# EAGLE design relocker_schematic (EAGLE 9.1.3)
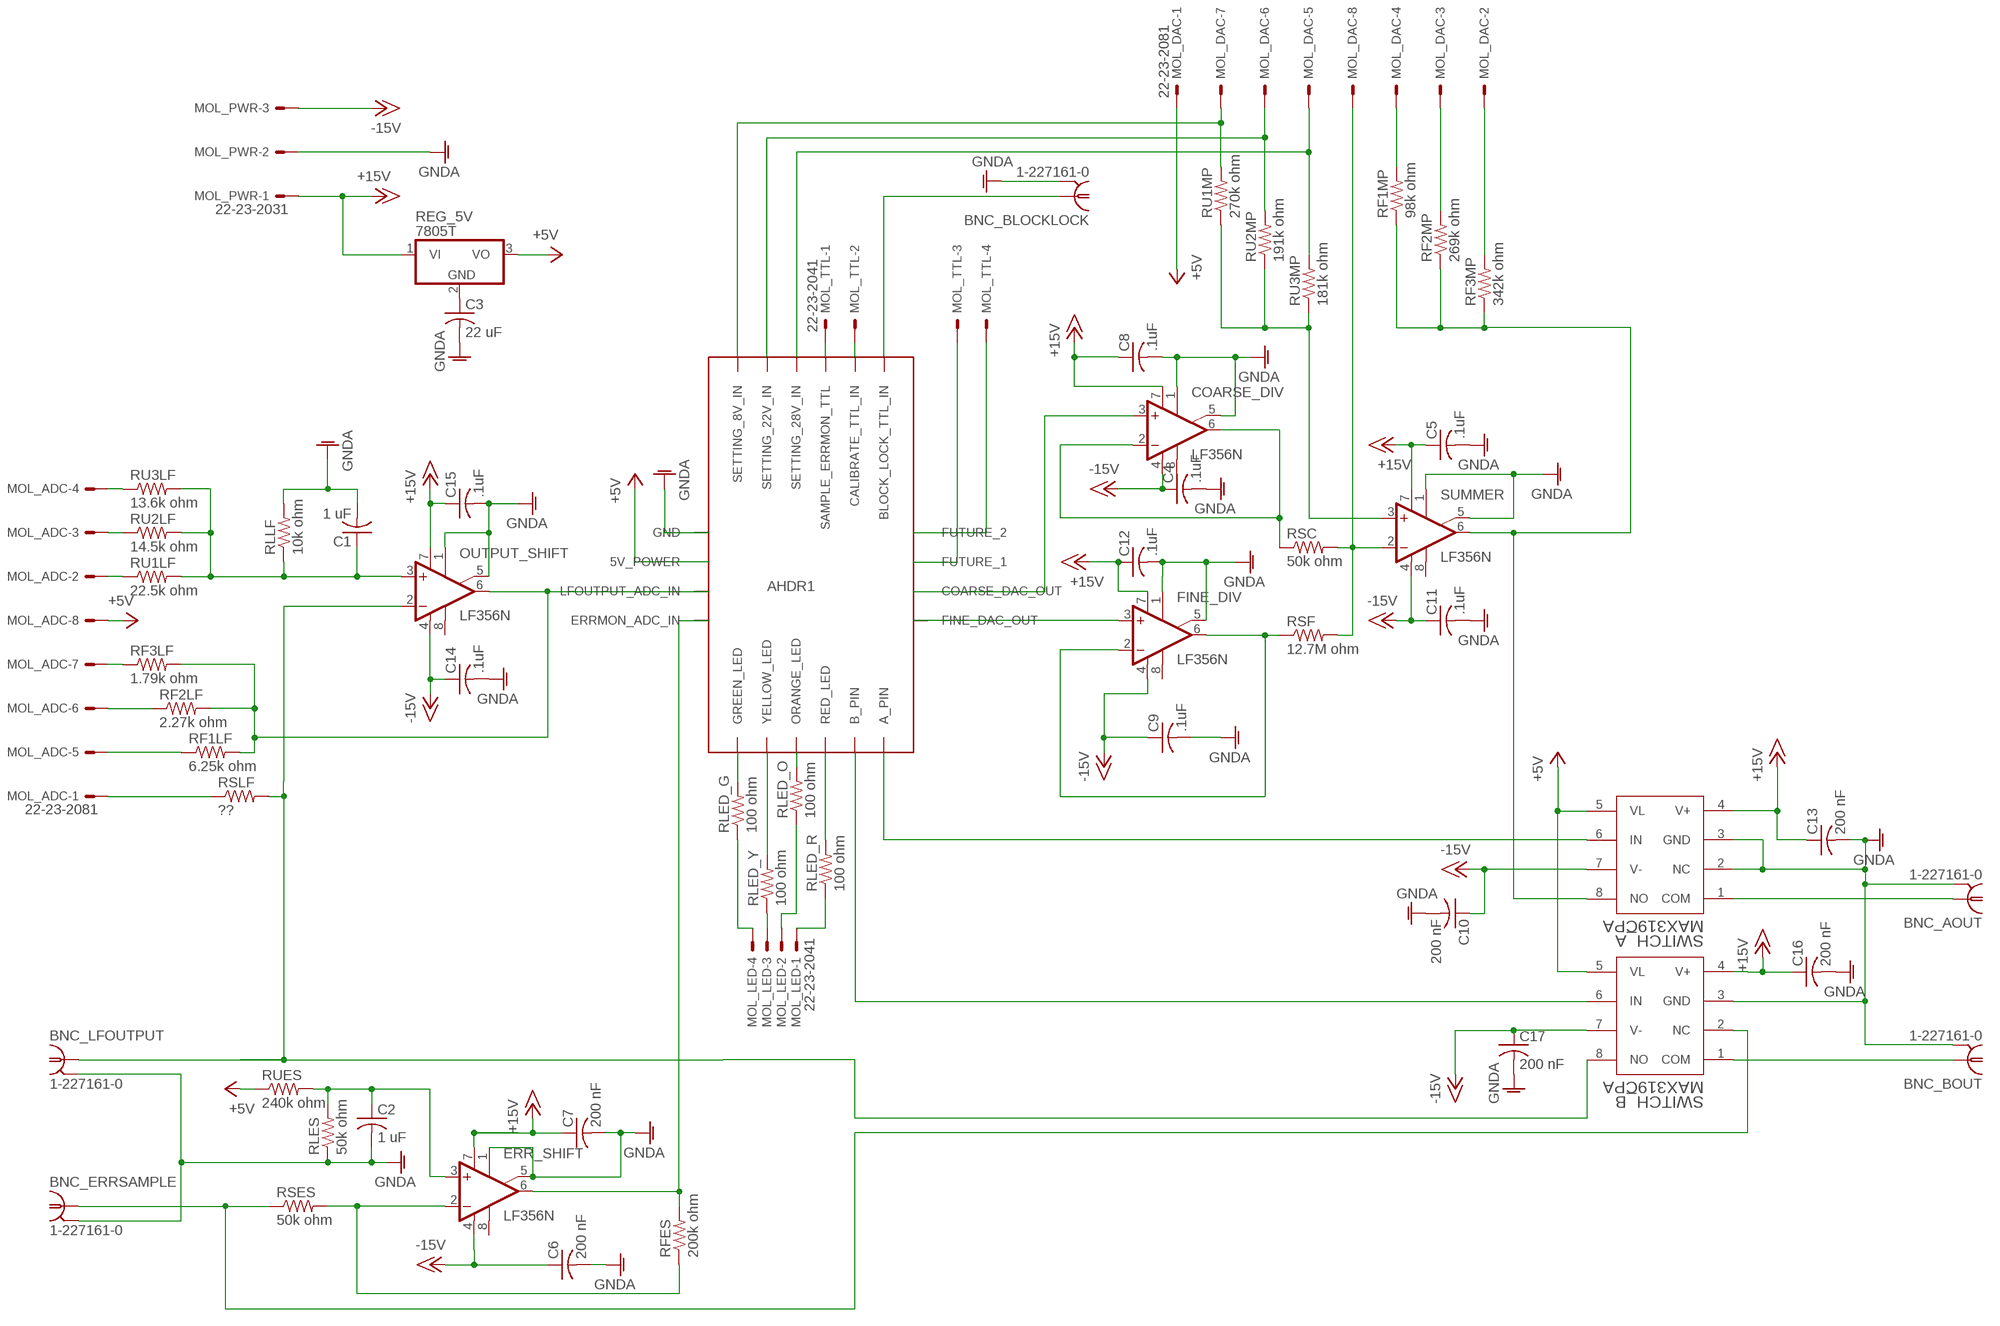
[diagram p0: schematic, sheet 1]

## Parts
AHDR1  FREESOC2_BREAKOUT  [FREESOC2_BREAKOUT]
BNC_AOUT  1-227161-0  [AMP_227161]
BNC_BLOCKLOCK  1-227161-0  [AMP_227161]
BNC_BOUT  1-227161-0  [AMP_227161]
BNC_ERRSAMPLE  1-227161-0  [AMP_227161]
BNC_LFOUTPUT  1-227161-0  [AMP_227161]
C1  1 uF  C-USC0805  [C0805]
C2  1 uF  C-USC0805  [C0805]
C3  22 uF  C-USC0805  [C0805]
C4  .1uF  C-USC0805  [C0805]
C5  .1uF  C-USC0805  [C0805]
C6  200 nF  C-USC0805  [C0805]
C7  200 nF  C-USC0805  [C0805]
C8  .1uF  C-USC0805  [C0805]
C9  .1uF  C-USC0805  [C0805]
C10  200 nF  C-USC0805  [C0805]
C11  .1uF  C-USC0805  [C0805]
C12  .1uF  C-USC0805  [C0805]
C13  200 nF  C-USC0805  [C0805]
C14  .1uF  C-USC0805  [C0805]
C15  .1uF  C-USC0805  [C0805]
C16  200 nF  C-USC0805  [C0805]
C17  200 nF  C-USC0805  [C0805]
COARSE_DIV  LF356N  [DIL08]
ERR_SHIFT  LF356N  [DIL08]
FINE_DIV  LF356N  [DIL08]
MOL_ADC  22-23-2081  [22-23-2081]
MOL_DAC  22-23-2081  [22-23-2081]
MOL_LED  22-23-2041  [22-23-2041]
MOL_PWR  22-23-2031  [22-23-2031]
MOL_TTL  22-23-2041  [22-23-2041]
OUTPUT_SHIFT  LF356N  [DIL08]
REG_5V  7805T  [TO220H]
RF1LF  6.25k ohm  R-US_R0805  [R0805]
RF1MP  98k ohm  R-US_R0805  [R0805]
RF2LF  2.27k ohm  R-US_R0805  [R0805]
RF2MP  269k ohm  R-US_R0805  [R0805]
RF3LF  1.79k ohm  R-US_R0805  [R0805]
RF3MP  342k ohm  R-US_R0805  [R0805]
RFES  200k ohm  R-US_R0805  [R0805]
RLED_G  100 ohm  R-US_R0805  [R0805]
RLED_O  100 ohm  R-US_R0805  [R0805]
RLED_R  100 ohm  R-US_R0805  [R0805]
RLED_Y  100 ohm  R-US_R0805  [R0805]
RLES  50k ohm  R-US_R0805  [R0805]
RLLF  10k ohm  R-US_R0805  [R0805]
RSC  50k ohm  R-US_R0805  [R0805]
RSES  50k ohm  R-US_R0805  [R0805]
RSF  12.7M ohm  R-US_R0805  [R0805]
RSLF  ??  R-US_R0805  [R0805]
RU1LF  22.5k ohm  R-US_R0805  [R0805]
RU1MP  270k ohm  R-US_R0805  [R0805]
RU2LF  14.5k ohm  R-US_R0805  [R0805]
RU2MP  191k ohm  R-US_R0805  [R0805]
RU3LF  13.6k ohm  R-US_R0805  [R0805]
RU3MP  181k ohm  R-US_R0805  [R0805]
RUES  240k ohm  R-US_R0805  [R0805]
SUMMER  LF356N  [DIL08]
SWITCH_A  MAX319CPA  [21-0043D_8]
SWITCH_B  MAX319CPA  [21-0043D_8]

## Nets
+5V: AHDR1.1(5V_POWER) MOL_ADC.8 MOL_DAC.1 REG_5V.3(VO) RUES.1 SWITCH_A.5(VL) SWITCH_B.5(VL)
+15V: C5.1 C7.1 C8.1 C12.1 C13.1 C15.1 C16.1 COARSE_DIV.7(V+) ERR_SHIFT.7(V+) FINE_DIV.7(V+) MOL_PWR.1 OUTPUT_SHIFT.7(V+) REG_5V.1(VI) SUMMER.7(V+) SWITCH_A.4(V+) SWITCH_B.4(V+)
-15V: C4.1 C6.1 C9.1 C10.1 C11.1 C14.1 C17.1 COARSE_DIV.4(V-) ERR_SHIFT.4(V-) FINE_DIV.4(V-) MOL_PWR.3 OUTPUT_SHIFT.4(V-) SUMMER.4(V-) SWITCH_A.7(V-) SWITCH_B.7(V-)
GNDA: AHDR1.2(GND) BNC_AOUT.2 BNC_BLOCKLOCK.2 BNC_BOUT.2 BNC_ERRSAMPLE.2 BNC_LFOUTPUT.2 C1.2 C2.2 C3.1 C3.2 C4.2 C5.2 C6.2 C7.2 C8.2 C9.2 C10.2 C11.2 C12.2 C13.2 C14.2 C15.2 C16.2 C17.2 COARSE_DIV.1(ON1) COARSE_DIV.5(ON2) ERR_SHIFT.1(ON1) ERR_SHIFT.5(ON2) FINE_DIV.1(ON1) FINE_DIV.5(ON2) MOL_PWR.2 OUTPUT_SHIFT.1(ON1) OUTPUT_SHIFT.5(ON2) REG_5V.2(GND) RLES.1 RLLF.2 SUMMER.1(ON1) SUMMER.5(ON2) SWITCH_A.2(NC) SWITCH_A.3(GND) SWITCH_B.3(GND)
N$1: AHDR1.10(COARSE_DAC_OUT) COARSE_DIV.3(+IN)
N$2: COARSE_DIV.2(-IN) COARSE_DIV.6(OUT) RSC.1
N$3: MOL_DAC.4 RF1MP.2
N$4: AHDR1.11(FINE_DAC_OUT) FINE_DIV.3(+IN)
N$5: AHDR1.12(BLOCK_LOCK_TTL_IN) BNC_BLOCKLOCK.1
N$6: AHDR1.17(RED_LED) RLED_R.2
N$7: AHDR1.18(ORANGE_LED) RLED_O.2
N$8: AHDR1.19(YELLOW_LED) RLED_Y.2
N$9: AHDR1.20(GREEN_LED) RLED_G.2
N$10: MOL_LED.4 RLED_G.1
N$11: MOL_LED.3 RLED_Y.1
N$12: MOL_LED.2 RLED_O.1
N$13: MOL_LED.1 RLED_R.1
N$14: BNC_AOUT.1 SWITCH_A.1(COM)
N$15: RF1MP.1 RF2MP.1 RF3MP.1 SUMMER.6(OUT) SWITCH_A.8(NO)
N$16: AHDR1.6(A_PIN) SWITCH_A.6(IN)
N$17: BNC_BOUT.1 SWITCH_B.1(COM)
N$18: BNC_ERRSAMPLE.1 RSES.1 SWITCH_B.2(NC)
N$19: AHDR1.9(SETTING_8V_IN) MOL_DAC.7 RU1MP.2
N$20: AHDR1.5(B_PIN) SWITCH_B.6(IN)
N$21: BNC_LFOUTPUT.1 OUTPUT_SHIFT.2(-IN) RSLF.2 SWITCH_B.8(NO)
N$22: AHDR1.8(SETTING_22V_IN) MOL_DAC.6 RU2MP.2
N$23: AHDR1.7(SETTING_28V_IN) MOL_DAC.5 RU3MP.2
N$24: AHDR1.3(LFOUTPUT_ADC_IN) OUTPUT_SHIFT.6(OUT) RF1LF.2 RF2LF.2 RF3LF.2
N$25: MOL_DAC.8 RSC.2 RSF.2 SUMMER.2(-IN)
N$26: FINE_DIV.2(-IN) FINE_DIV.6(OUT) RSF.1
N$27: MOL_DAC.3 RF2MP.2
N$28: MOL_DAC.2 RF3MP.2
N$29: RU1MP.1 RU2MP.1 RU3MP.1 SUMMER.3(+IN)
N$30: MOL_ADC.1 RSLF.1
N$31: MOL_ADC.5 RF1LF.1
N$32: MOL_ADC.6 RF2LF.1
N$33: MOL_ADC.7 RF3LF.1
N$34: MOL_ADC.2 RU1LF.1
N$35: MOL_ADC.3 RU2LF.1
N$36: MOL_ADC.4 RU3LF.1
N$37: C1.1 OUTPUT_SHIFT.3(+IN) RLLF.1 RU1LF.2 RU2LF.2 RU3LF.2
N$38: ERR_SHIFT.2(-IN) RFES.1 RSES.2
N$39: C2.1 ERR_SHIFT.3(+IN) RLES.2 RUES.2
N$40: AHDR1.4(ERRMON_ADC_IN) ERR_SHIFT.6(OUT) RFES.2
N$41: AHDR1.15(FUTURE_1) MOL_TTL.3
N$42: AHDR1.16(FUTURE_2) MOL_TTL.4
N$43: AHDR1.14(CALIBRATE_TTL_IN) MOL_TTL.2
N$44: AHDR1.13(SAMPLE_ERRMON_TTL) MOL_TTL.1
Unconnected: COARSE_DIV.8(OPT) ERR_SHIFT.8(OPT) FINE_DIV.8(OPT) OUTPUT_SHIFT.8(OPT) SUMMER.8(OPT)

## Library data of the parts
AHDR1 = custom_parts_library:FREESOC2_BREAKOUT: Breakout FreeSoc2 Pins For the relocker project
BNC_AOUT BNC_BLOCKLOCK BNC_BOUT BNC_ERRSAMPLE BNC_LFOUTPUT = con-coax:?227161*: JACK, RIGHT ANGLE, 50 OHM, PCB, BNC Source: amp_227161.pdf; MF: TYCO ELECTRONICS; MPN: 1-227161; OC_FARNELL: unknown; OC_NEWARK: 33B3200
C1-C17 = rcl:C-US: CAPACITOR, American symbol; SPICEPREFIX: C
COARSE_DIV ERR_SHIFT FINE_DIV OUTPUT_SHIFT SUMMER = linear:LF356: OP AMP
MOL_ADC MOL_DAC = con-molex:22-23-2081: .100" (2.54mm) Center Header - 8 Pin; MF: MOLEX; MPN: 22-23-2081; OC_FARNELL: 1756826; OC_NEWARK: 01C7592
MOL_LED MOL_TTL = con-molex:22-23-2041: .100" (2.54mm) Center Header - 4 Pin; MF: MOLEX; MPN: 22-23-2041; OC_FARNELL: 1462920; OC_NEWARK: 38C0355
MOL_PWR = con-molex:22-23-2031: .100" (2.54mm) Center Header - 3 Pin; MF: MOLEX; MPN: 22-23-2031; OC_FARNELL: 1462950; OC_NEWARK: 30C0862
REG_5V = linear:78*: Positive VOLTAGE REGULATOR Source: http://cache.national.com/ds/LM/LM78L05.pdf http://www.fairchildsemi.com/ds/LM/LM7805.pdf
RF1LF RF1MP RF2LF RF2MP RF3LF RF3MP RFES RLED_G RLED_O RLED_R RLED_Y RLES RLLF RSC RSES RSF RSLF RU1LF RU1MP RU2LF RU2MP RU3LF RU3MP RUES = rcl:R-US_: RESISTOR, American symbol; SPICEPREFIX: R
SWITCH_A SWITCH_B = custom_parts_library:MAX319CPA: Maxim MAX319CPA This switch was imported with Ultra Librarian and then the schematic was edited, but the footprint looks good, I hope.; MANUFACTURER_PART_NUMBER: MAX319CPA; VENDOR: Maxim

## Board
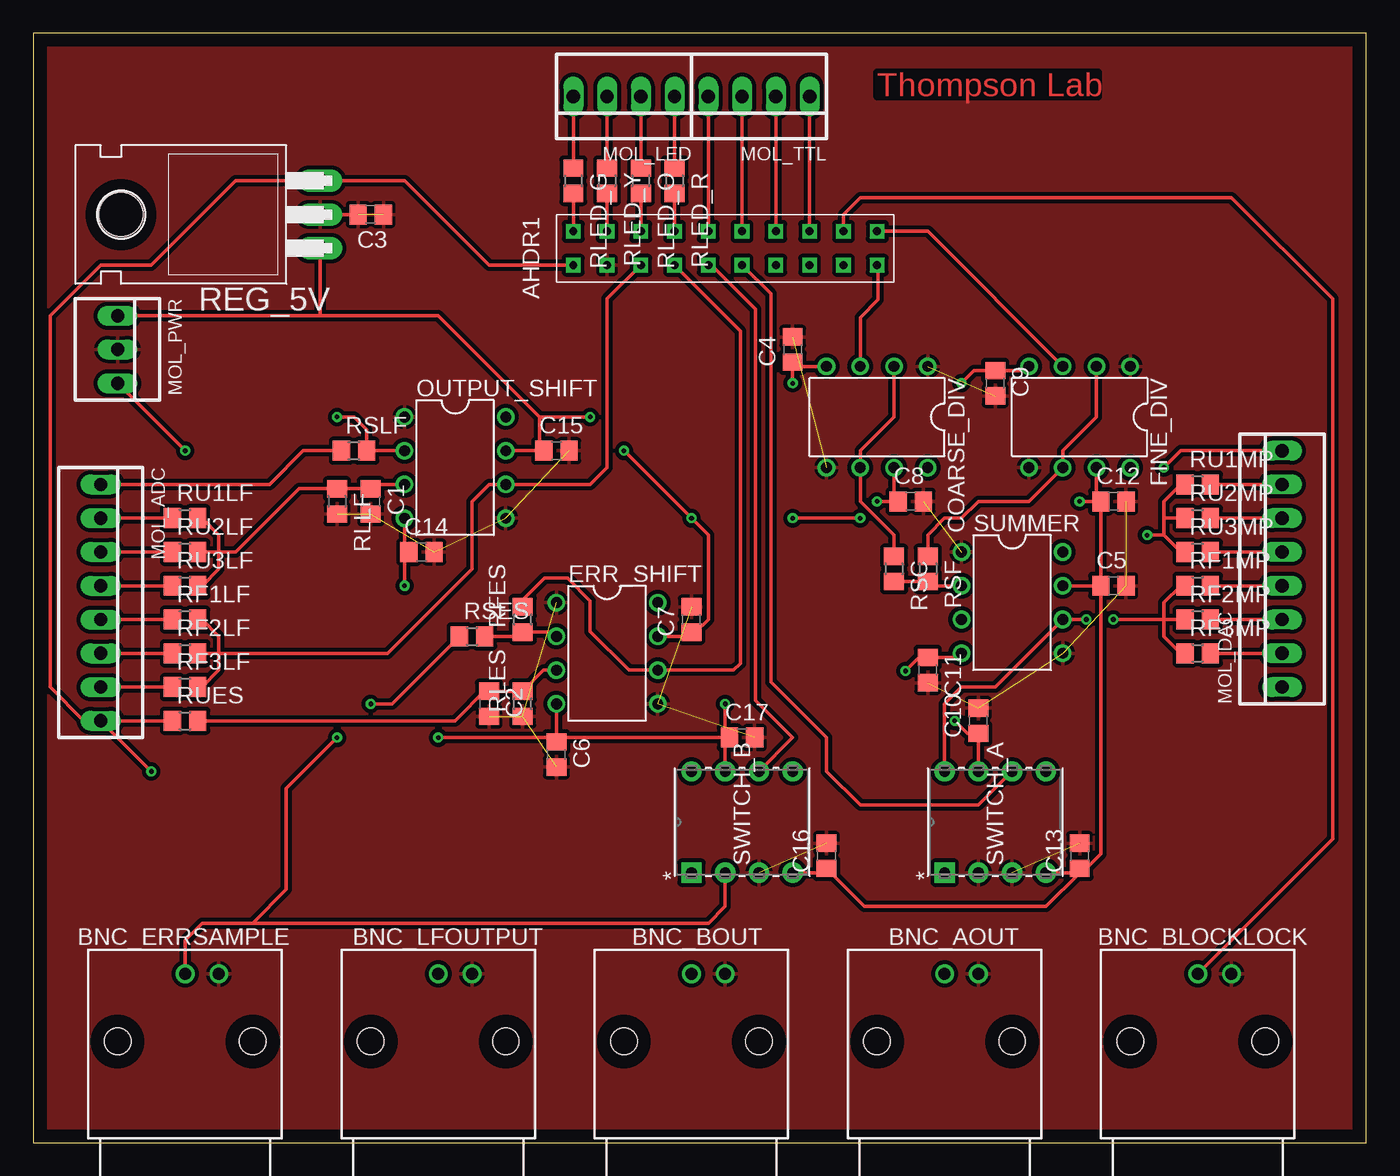
[diagram p1: board, top side]
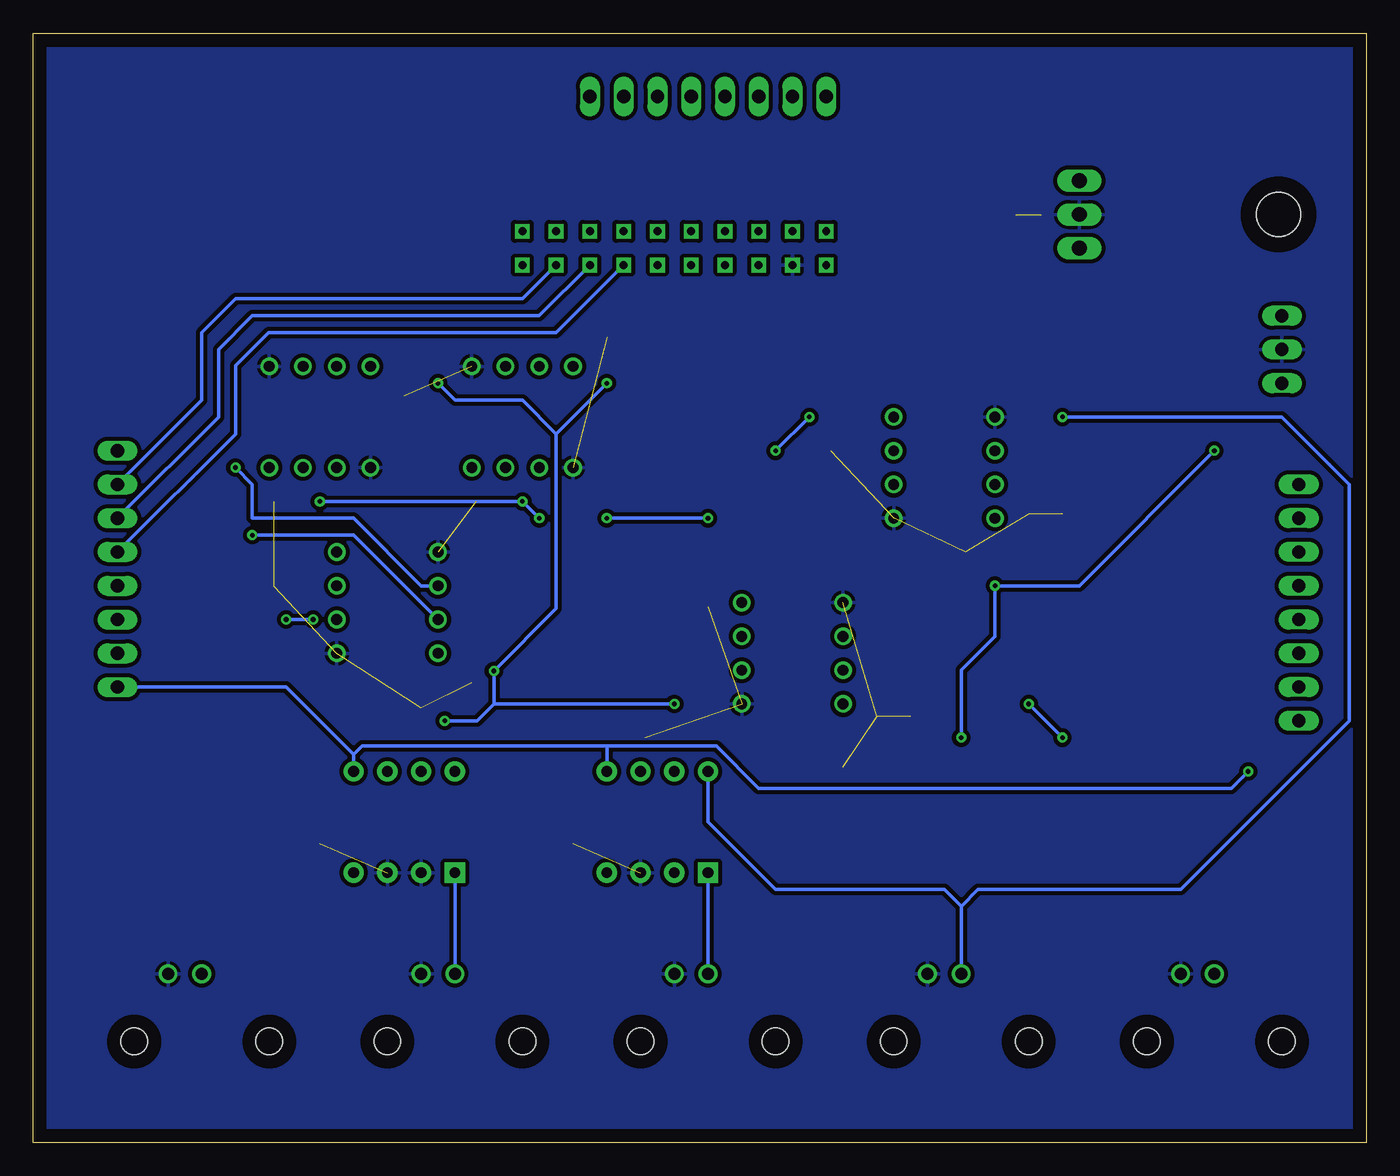
[diagram p2: board, bottom side, seen from below]

Size 100.31 x 83.49 mm. Coordinates in mm from the lower left corner, seen from the top.
Outline: 0,0 100.31,0 100.31,83.49 0,83.49 0,0
Copper layers (1*16): Top 0.035mm / dielectric 1.5mm / Bottom 0.035mm
Design rules "default": minimum track width 6mil, minimum drill 0.35mm, track to track 6mil, track to pad 6mil, pad to pad 6mil, via to via 6mil, smd to smd 6mil, copper to edge 40mil, drill to drill 6mil, minimum pad ring 10mil, minimum via ring 8mil, stop-mask expansion 4mil, vias tented up to drill 0mil, thermal gap 10mil

### Footprints (pad centres in the part's own frame; a part is rotated, then mirrored left to right if it is on the bottom)
FREESOC2_BREAKOUT = drill 0.6 square: 1 1.27,-1.27; 2 1.27,-3.81; 3 1.27,-6.35; 4 1.27,-8.89; 5 1.27,-11.43; 6 1.27,-13.97; 7 1.27,-16.51; 8 1.27,-19.05; 9 1.27,-21.59; 10 1.27,-24.13; 11 3.81,-24.13; 12 3.81,-21.59; 13 3.81,-19.05; 14 3.81,-16.51; 15 3.81,-13.97; 16 3.81,-11.43; 17 3.81,-8.89; 18 3.81,-6.35; 19 3.81,-3.81; 20 3.81,-1.27
AMP_227161 = drill 0.9 pad 1.27: 1 0,-5.08; 2 -2.54,-5.08 | hole 2: -5.08,0; 5.08,0
C0805 = smd 1.3 x 1.5: 1 -0.95,0; 2 0.95,0
DIL08 = drill 0.813 pad 1.27: 1 -3.81,-3.81; 2 -1.27,-3.81; 3 1.27,-3.81; 4 3.81,-3.81; 5 3.81,3.81; 6 1.27,3.81; 7 -1.27,3.81; 8 -3.81,3.81
22-23-2081 = drill 1 long: 1 -8.89,0; 2 -6.35,0; 3 -3.81,0; 4 -1.27,0; 5 1.27,0; 6 3.81,0; 7 6.35,0; 8 8.89,0
22-23-2041 = drill 1 long: 1 -3.81,0; 2 -1.27,0; 3 1.27,0; 4 3.81,0
22-23-2031 = drill 1 long: 1 -2.54,0; 2 0,0; 3 2.54,0
TO220H = drill 1.118 long: 1 -2.54,-10.16; 2 0,-10.16; 3 2.54,-10.16 | hole 3.302: 0,4.826
R0805 = smd 1.3 x 1.5: 1 -0.95,0; 2 0.95,0
21-0043D_8 = drill 0.813 pad 1.524 square: 1 -7.62,7.62 | drill 0.813 pad 1.524: 2 -7.62,5.08; 3 -7.62,2.54; 4 -7.62,0; 5 0,0; 6 0,2.54; 7 0,5.08; 8 0,7.62

### Placement (x,y rotation side)
AHDR1  39.37,64.77 90 top
BNC_AOUT  68.58,7.62 180 top
BNC_BLOCKLOCK  87.63,7.62 180 top
BNC_BOUT  49.53,7.62 180 top
BNC_ERRSAMPLE  11.43,7.62 180 top
BNC_LFOUTPUT  30.48,7.62 180 top
C1  25.4,48.26 270 top
C2  34.29,33.02 270 top
C3  25.4,69.85 180 top
C4  57.15,59.69 90 top
C5  81.28,41.91 0 top
C6  39.37,29.21 270 top
C7  49.53,39.37 90 top
C8  66.04,48.26 0 top
C9  72.39,57.15 270 top
C10  71.12,31.75 90 top
C11  67.31,35.56 270 top
C12  81.28,48.26 0 top
C13  78.74,21.59 90 top
C14  29.21,44.45 0 top
C15  39.37,52.07 0 top
C16  59.69,21.59 90 top
C17  53.34,30.48 0 top
COARSE_DIV  63.5,54.61 180 top
ERR_SHIFT  43.18,36.83 270 top
FINE_DIV  78.74,54.61 180 top
MOL_ADC  5.08,40.64 270 top
MOL_DAC  93.98,43.18 90 top
MOL_LED  44.45,78.74 180 top
MOL_PWR  6.35,59.69 270 top
MOL_TTL  54.61,78.74 180 top
OUTPUT_SHIFT  31.75,50.8 270 top
REG_5V  11.43,69.85 90 top
RF1LF  11.43,39.37 0 top
RF1MP  87.63,41.91 0 top
RF2LF  11.43,36.83 0 top
RF2MP  87.63,39.37 0 top
RF3LF  11.43,34.29 0 top
RF3MP  87.63,36.83 0 top
RFES  36.83,39.37 90 top
RLED_G  40.64,72.39 270 top
RLED_O  45.72,72.39 270 top
RLED_R  48.26,72.39 270 top
RLED_Y  43.18,72.39 270 top
RLES  36.83,33.02 90 top
RLLF  22.86,48.26 270 top
RSC  64.77,43.18 270 top
RSES  33.02,38.1 0 top
RSF  67.31,43.18 270 top
RSLF  24.13,52.07 0 top
RU1LF  11.43,46.99 0 top
RU1MP  87.63,49.53 0 top
RU2LF  11.43,44.45 0 top
RU2MP  87.63,46.99 0 top
RU3LF  11.43,41.91 0 top
RU3MP  87.63,44.45 0 top
RUES  11.43,31.75 0 top
SUMMER  73.66,40.64 270 top
SWITCH_A  76.2,27.94 90 top
SWITCH_B  57.15,27.94 90 top

### Tracks (layer width: path | path; a pad name or v marks a point on that pad's centre or on a via)
+5V  (via drill 0.35)
  Top 0.254: MOL_ADC.8 3.81,31.75 1.27,34.29 1.27,62.23 5.08,66.04 8.89,66.04 15.24,72.39 REG_5V.3 27.94,72.39 34.29,66.04 AHDR1.1 | MOL_ADC.8 RUES.1 | v8.89,27.94 MOL_ADC.8
  Bottom 0.254: 57.15,29.84 75.56,29.84 76.2,29.21 | 57.15,29.84 48.89,29.84 45.72,26.67 10.16,26.67 v8.89,27.94 | SWITCH_A.5 76.2,29.21 | SWITCH_B.5 57.15,29.84 | 76.2,29.21 81.28,34.29 MOL_DAC.1
+15V  (via drill 0.35)
  Top 0.254: 21.59,62.23 30.48,62.23 38.1,54.61 | OUTPUT_SHIFT.7 C15.1 38.1,52.39 38.1,54.61 | 78.74,20.32 C13.1 79.25,20.64 80.33,21.72 C5.1 | SWITCH_A.4 78.74,20.32 | SWITCH_B.4 59.69,20.32 C16.1 62.55,17.78 76.2,17.78 78.74,20.32 | v41.91,54.61 38.1,54.61 | 80.01,48.26 C12.1 C5.1 | 80.01,48.26 v78.74,48.26 | v63.5,48.26 64.77,48.26 | 64.77,48.26 C8.1 | v62.23,46.99 v57.15,46.99 | SUMMER.7 C5.1 | FINE_DIV.7 80.01,48.26 | COARSE_DIV.7 64.77,48.26 | MOL_PWR.1 21.59,62.23 | v44.45,52.07 v49.53,46.99 50.8,45.72 50.8,39.37 49.85,38.42 C7.1 49.21,38.1 ERR_SHIFT.7 | REG_5V.1 21.59,62.23
  Bottom 0.254: v44.45,52.07 v41.91,54.61 | v78.74,48.26 v63.5,48.26 v62.23,46.99 | v57.15,46.99 v49.53,46.99
-15V  (via drill 0.35)
  Top 0.254: OUTPUT_SHIFT.4 27.94,44.77 C14.1 27.94,44.45 v27.94,41.91 | FINE_DIV.4 74.61,58.1 C9.1 70.8,58.1 v69.85,57.15 | SUMMER.4 69.53,36.51 C11.1 66.65,36.51 v65.65,35.5 | v69.34,31.75 70.29,30.8 C10.1 SWITCH_A.7 | 52.07,30.48 C17.1 52.07,30.8 v52.07,33.02 | SWITCH_B.7 52.07,30.48 | COARSE_DIV.4 57.47,58.42 C4.1 v57.15,57.15 | v11.43,52.07 MOL_PWR.3 | C6.1 ERR_SHIFT.4 | C6.1 39.05,30.48 v30.48,30.48 | C6.1 39.69,30.48 52.07,30.48
  Bottom 0.254: 60.96,53.34 60.96,40.19 v65.65,35.5 65.65,33.02 | v11.43,52.07 21.59,41.91 v27.94,41.91 27.94,38.1 30.48,35.56 v30.48,30.48 | v52.07,33.02 65.65,33.02 | 65.65,33.02 66.92,31.75 v69.34,31.75 | v69.85,57.15 68.58,55.88 63.5,55.88 60.96,53.34 | v57.15,57.15 60.96,53.34
GNDA  (19 unrouted)
  Top 0.254: C3.2 REG_5V.2
  pour Bottom (isolate 0.305): 0,100.33 100.33,100.33 100.33,0 0,0
  pour Top (isolate 0.305): 0,83.82 100.33,83.82 100.33,0 0,0
N$1
  Top 0.254: AHDR1.10 63.5,65.91 63.56,65.85 63.56,63.44 62.23,62.1 COARSE_DIV.3
N$2
  Top 0.254: RSC.1 64.77,45.72 62.23,48.26 COARSE_DIV.6 62.23,52.07 64.77,54.61 COARSE_DIV.2
N$3
  Top 0.254: RF1MP.2 MOL_DAC.4
N$4
  Top 0.254: AHDR1.11 67.31,68.58 FINE_DIV.3
N$5
  Top 0.254: AHDR1.12 60.96,69.85 62.23,71.12 90.17,71.12 97.79,63.5 97.79,22.86 BNC_BLOCKLOCK.1
N$6
  Top 0.254: AHDR1.17 RLED_R.2
N$7
  Top 0.254: AHDR1.18 RLED_O.2
N$8
  Top 0.254: AHDR1.19 RLED_Y.2
N$9
  Top 0.254: AHDR1.20 RLED_G.2
N$10
  Top 0.254: RLED_G.1 MOL_LED.4
N$11
  Top 0.254: RLED_Y.1 MOL_LED.3
N$12
  Top 0.254: RLED_O.1 MOL_LED.2
N$13
  Top 0.254: RLED_R.1 MOL_LED.1
N$14
  Bottom 0.254: SWITCH_A.1 BNC_AOUT.1
N$15  (via drill 0.35)
  Top 0.254: SWITCH_A.8 68.58,33.02 69.85,34.29 72.39,34.29 74.93,36.83 SUMMER.6 v79.25,39.37 | RF3MP.1 86.36,36.83 85.09,38.1 85.09,39.37 | RF1MP.1 86.36,41.91 85.09,40.64 85.09,39.37 | RF2MP.1 85.09,39.37 | v81.28,39.37 85.09,39.37
  Bottom 0.254: v79.25,39.37 v81.28,39.37
N$16
  Top 0.254: AHDR1.6 55.5,63.88 55.5,34.67 59.69,30.48 59.69,27.94 62.23,25.4 71.12,25.4 SWITCH_A.6
N$17
  Bottom 0.254: SWITCH_B.1 BNC_BOUT.1
N$18  (via drill 0.35)
  Top 0.254: BNC_ERRSAMPLE.1 11.43,15.24 12.7,16.51 16.51,16.51 | SWITCH_B.2 52.07,17.78 50.8,16.51 16.51,16.51 | v22.86,30.48 19.05,26.67 19.05,19.05 16.51,16.51 | v25.4,33.02 26.99,33.02 RSES.1
  Bottom 0.254: v25.4,33.02 v22.86,30.48
N$19
  Top 0.254: RU1MP.2 MOL_DAC.7
  Bottom 0.254: AHDR1.9 63.5,63.5 85.09,63.5 87.63,60.96 87.63,55.88 MOL_DAC.7
N$20
  Top 0.254: AHDR1.5 50.8,66.27 54.36,62.72 54.36,33.27 57.15,30.48 SWITCH_B.6
N$21  (via drill 0.35)
  Top 0.254: OUTPUT_SHIFT.2 25.4,52.07 RSLF.2 25.08,53.66 24.13,54.61 v22.86,54.61
  Bottom 0.254: 5.08,53.34 1.27,49.53 1.27,31.75 13.97,19.05 29.21,19.05 30.48,17.78 | 5.08,53.34 | 5.08,53.34 6.35,54.61 v22.86,54.61 | BNC_LFOUTPUT.1 30.48,17.78 | 30.48,17.78 31.75,19.05 44.45,19.05 49.53,24.13 SWITCH_B.8
N$22
  Top 0.254: RU2MP.2 MOL_DAC.6
  Bottom 0.254: AHDR1.8 62.23,62.23 83.82,62.23 86.36,59.69 86.36,54.61 MOL_DAC.6
N$23
  Top 0.254: RU3MP.2 MOL_DAC.5
  Bottom 0.254: AHDR1.7 60.96,60.96 82.61,60.96 85.09,58.48 85.09,53.34 MOL_DAC.5
N$24
  Top 0.254: RF3LF.2 12.7,34.29 13.97,35.56 13.97,36.83 | 13.97,36.83 13.97,38.1 12.7,39.37 RF1LF.2 | RF2LF.2 13.97,36.83 | 13.97,36.83 26.67,36.83 33.02,43.18 33.02,48.26 34.29,49.53 OUTPUT_SHIFT.6 41.91,49.53 43.18,50.8 43.18,62.23 43.18,63.5 AHDR1.3
N$25  (via drill 0.35)
  Top 0.254: RSC.2 RSF.2 67.63,41.91 SUMMER.2 | v85.09,50.8 86.36,52.07 MOL_DAC.8
  Bottom 0.254: SUMMER.2 71.12,41.91 76.2,46.99 83.82,46.99 83.82,49.53 v85.09,50.8
N$26
  Top 0.254: RSF.1 67.31,45.72 68.58,46.99 69.85,46.99 71.12,48.26 74.93,48.26 FINE_DIV.6 77.47,52.07 80.01,54.61 FINE_DIV.2
N$27
  Top 0.254: MOL_DAC.3 RF2MP.2
N$28
  Top 0.254: RF3MP.2 MOL_DAC.2
N$29  (via drill 0.35)
  Top 0.254: RU3MP.1 86.36,44.45 85.09,45.72 | 85.09,46.99 85.09,48.26 86.36,49.53 RU1MP.1 | RU2MP.1 85.09,46.99 | 85.09,46.99 85.09,45.72 | 85.09,45.72 | 85.09,45.72 v83.82,45.72
  Bottom 0.254: SUMMER.3 76.2,45.72 v83.82,45.72
N$30
  Top 0.254: RSLF.1 20.32,52.07 17.78,49.53 MOL_ADC.1
N$31
  Top 0.254: MOL_ADC.5 RF1LF.1
N$32
  Top 0.254: RF2LF.1 MOL_ADC.6
N$33
  Top 0.254: RF3LF.1 MOL_ADC.7
N$34
  Top 0.254: RU1LF.1 MOL_ADC.2
N$35
  Top 0.254: MOL_ADC.3 RU2LF.1
N$36
  Top 0.254: RU3LF.1 MOL_ADC.4
N$37
  Top 0.254: RU1LF.2 12.7,46.99 13.97,45.72 13.97,44.45 | 13.97,44.45 13.97,43.18 12.7,41.91 RU3LF.2 | RU2LF.2 13.97,44.45 | 13.97,44.45 | 13.97,44.45 15.24,44.45 20,49.21 RLLF.1 C1.1 25.72,49.53 OUTPUT_SHIFT.3
N$38
  Top 0.254: ERR_SHIFT.2 39.05,38.42 RFES.1 36.51,38.1 RSES.2
N$39
  Top 0.254: RUES.2 31.75,31.75 34.13,34.13 C2.1 RLES.2 38.42,35.56 ERR_SHIFT.3
N$40
  Top 0.254: AHDR1.4 53.21,61.09 53.21,36.07 52.7,35.56 ERR_SHIFT.6 44.83,35.56 41.91,38.48 41.91,40.77 40.2,42.48 38.48,42.48 36.83,40.83 RFES.2
N$41
  Top 0.254: AHDR1.15 MOL_TTL.3
N$42
  Top 0.254: AHDR1.16 MOL_TTL.4
N$43
  Top 0.254: AHDR1.14 MOL_TTL.2
N$44
  Top 0.254: AHDR1.13 MOL_TTL.1

### Text on the board
Top: Thompson Lab